# Altium project Core_MultiBoard.PrjPCB
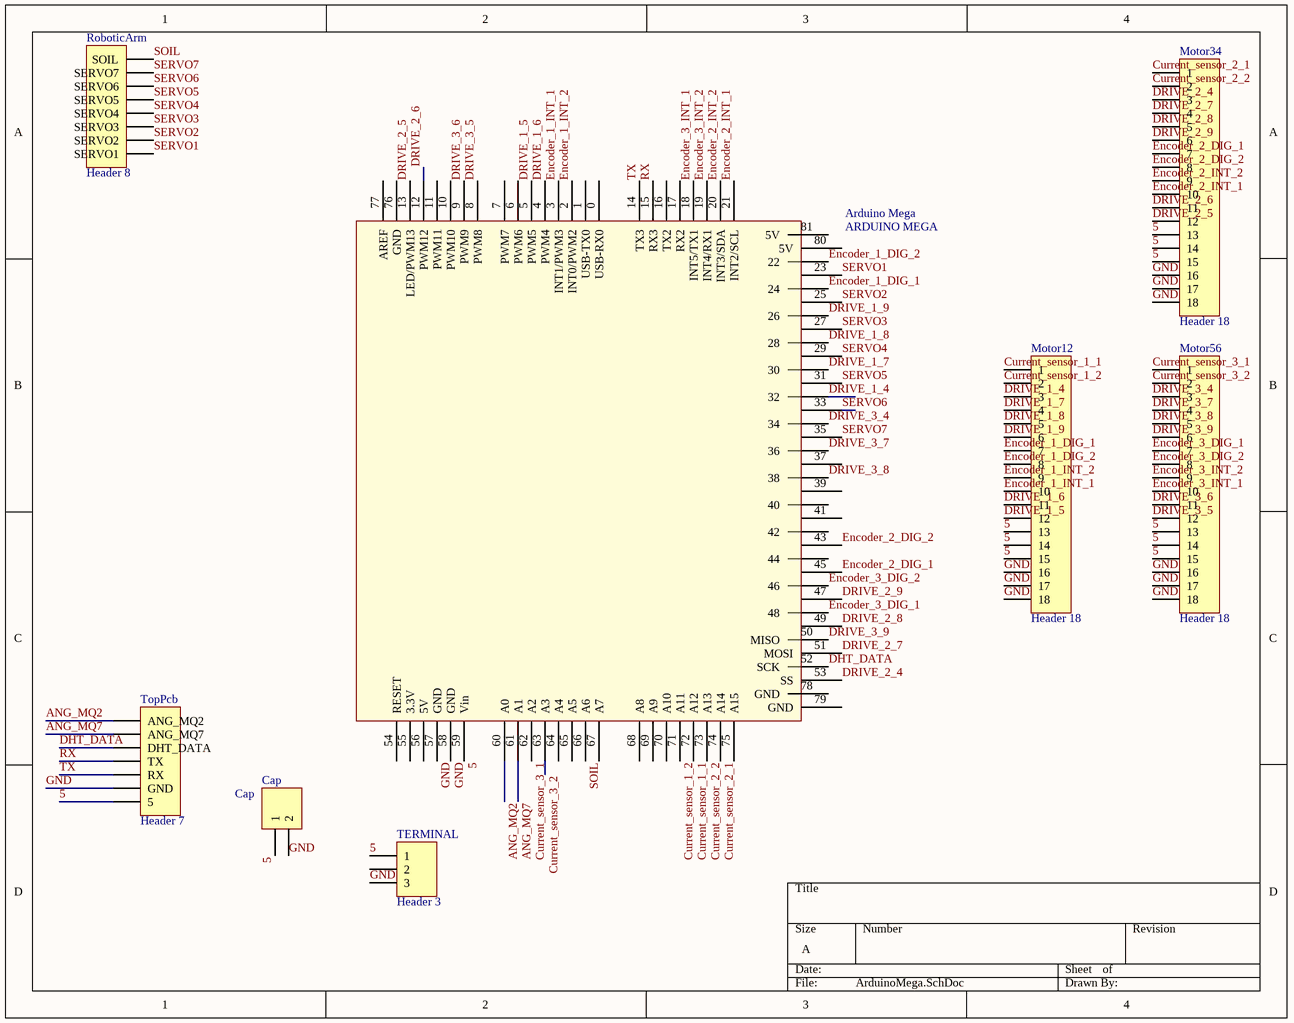
[diagram p0: ArduinoMega.SchDoc]
2 sheets, 11 parts. Net scope: global (net labels, ports and power ports of the same name join across sheets).
Board files: ArduinoMega.PcbDoc, MotorDriver.PcbDoc
Sheets:
  ArduinoMega.SchDoc
  MotorDriver.SchDoc

## Sheet ArduinoMega.SchDoc
size A; SheetNumber: 1; SheetTotal: 1

### Parts
Arduino_Mega  ARDUINO MEGA  [ARDUINO MEGA]
Cap  Cap  [HDR1X2]
Motor12  Header 18  [HDR1X18]
Motor34  Header 18  [HDR1X18]
Motor56  Header 18  [HDR1X18]
RoboticArm  Header 8  [HDR1X8]
TERMINAL  Header 3  [HDR1X3]
TopPcb  Header 7  [HDR1X7]

### Nets
5: Arduino_Mega.59(Vin) Cap.1 Motor12.13 Motor12.14 Motor12.15 Motor34.13 Motor34.14 Motor34.15 Motor56.13 Motor56.14 Motor56.15 TERMINAL.1 TopPcb.7(5)
ANG_MQ2: Arduino_Mega.60(A0) TopPcb.1(ANG_MQ2)
ANG_MQ7: Arduino_Mega.61(A1) TopPcb.2(ANG_MQ7)
Current_sensor_1_1: Arduino_Mega.72(A12) Motor12.1
Current_sensor_1_2: Arduino_Mega.71(A11) Motor12.2
Current_sensor_2_1: Arduino_Mega.74(A14) Motor34.1
Current_sensor_2_2: Arduino_Mega.73(A13) Motor34.2
Current_sensor_3_1: Arduino_Mega.62(A2) Motor56.1
Current_sensor_3_2: Arduino_Mega.63(A3) Motor56.2
DHT_DATA: Arduino_Mega.52(SCK) TopPcb.3(DHT_DATA)
DRIVE_1_4: Arduino_Mega.32 Motor12.3
DRIVE_1_5: Arduino_Mega.5(PWM5) Motor12.12
DRIVE_1_6: Arduino_Mega.4(PWM4) Motor12.11
DRIVE_1_7: Arduino_Mega.30 Motor12.4
DRIVE_1_8: Arduino_Mega.28 Motor12.5
DRIVE_1_9: Arduino_Mega.26 Motor12.6
DRIVE_2_4: Arduino_Mega.53(SS) Motor34.3
DRIVE_2_5: Arduino_Mega.13(LED/PWM13) Motor34.12
DRIVE_2_6: Arduino_Mega.12(PWM12) Motor34.11
DRIVE_2_7: Arduino_Mega.51(MOSI) Motor34.4
DRIVE_2_8: Arduino_Mega.49 Motor34.5
DRIVE_2_9: Arduino_Mega.47 Motor34.6
DRIVE_3_4: Arduino_Mega.34 Motor56.3
DRIVE_3_5: Arduino_Mega.8(PWM8) Motor56.12
DRIVE_3_6: Arduino_Mega.9(PWM9) Motor56.11
DRIVE_3_7: Arduino_Mega.36 Motor56.4
DRIVE_3_8: Arduino_Mega.38 Motor56.5
DRIVE_3_9: Arduino_Mega.50(MISO) Motor56.6
Encoder_1_DIG_1: Arduino_Mega.24 Motor12.7
Encoder_1_DIG_2: Arduino_Mega.22 Motor12.8
Encoder_1_INT_1: Arduino_Mega.3(INT1/PWM3) Motor12.10
Encoder_1_INT_2: Arduino_Mega.2(INT0/PWM2) Motor12.9
Encoder_2_DIG_1: Arduino_Mega.45 Motor34.7
Encoder_2_DIG_2: Arduino_Mega.43 Motor34.8
Encoder_2_INT_1: Arduino_Mega.21(INT2/SCL) Motor34.10
Encoder_2_INT_2: Arduino_Mega.20(INT3/SDA) Motor34.9
Encoder_3_DIG_1: Arduino_Mega.48 Motor56.7
Encoder_3_DIG_2: Arduino_Mega.46 Motor56.8
Encoder_3_INT_1: Arduino_Mega.18(INT5/TX1) Motor56.10
Encoder_3_INT_2: Arduino_Mega.19(INT4/RX1) Motor56.9
GND: Arduino_Mega.57(GND) Arduino_Mega.58(GND) Cap.2 Motor12.16 Motor12.17 Motor12.18 Motor34.16 Motor34.17 Motor34.18 Motor56.16 Motor56.17 Motor56.18 TERMINAL.3 TopPcb.6(GND)
RX: Arduino_Mega.15(RX3) TopPcb.4(TX)
SERVO1: Arduino_Mega.23 RoboticArm.1(SERVO1)
SERVO2: Arduino_Mega.25 RoboticArm.2(SERVO2)
SERVO3: Arduino_Mega.27 RoboticArm.3(SERVO3)
SERVO4: Arduino_Mega.29 RoboticArm.4(SERVO4)
SERVO5: Arduino_Mega.31 RoboticArm.5(SERVO5)
SERVO6: Arduino_Mega.33 RoboticArm.6(SERVO6)
SERVO7: Arduino_Mega.35 RoboticArm.7(SERVO7)
SOIL: Arduino_Mega.66(A6) RoboticArm.8(SOIL)
TX: Arduino_Mega.14(TX3) TopPcb.5(RX)

Not connected (* = marked no-connect by the designer): Arduino_Mega 0(USB-RX0) 1(USB-TX0) 6(PWM6) 7(PWM7) 10(PWM10) 11(PWM11) 16(TX2) 17(RX2) 37 39 40 41 42 44 54(RESET) 55(3.3V) 56(5V) 64(A4) 65(A5) 67(A7) 68(A8) 69(A9) 70(A10) 75(A15) 76(GND) 77(AREF) 78(GND) 79(GND) 80(5V) 81(5V); TERMINAL 2

### Library data of the parts
Cap = Header 2: Header, 2-Pin; LatestRevisionDate: 17-Jul-2002; LatestRevisionNote: Re-released for DXP Platform.; Publisher: Altium Limited
Motor12 Motor34 Motor56 = Header 18: Header, 18-Pin; LatestRevisionDate: 17-Jul-2002; LatestRevisionNote: Re-released for DXP Platform.; Publisher: Altium Limited
RoboticArm = Header 8: Header, 8-Pin; LatestRevisionDate: 17-Jul-2002; LatestRevisionNote: Re-released for DXP Platform.; Publisher: Altium Limited
TERMINAL = Header 3: Header, 3-Pin; LatestRevisionDate: 17-Jul-2002; LatestRevisionNote: Re-released for DXP Platform.; Publisher: Altium Limited
TopPcb = Header 7: Header, 7-Pin; LatestRevisionDate: 17-Jul-2002; LatestRevisionNote: Re-released for DXP Platform.; Publisher: Altium Limited

## Sheet MotorDriver.SchDoc
size A
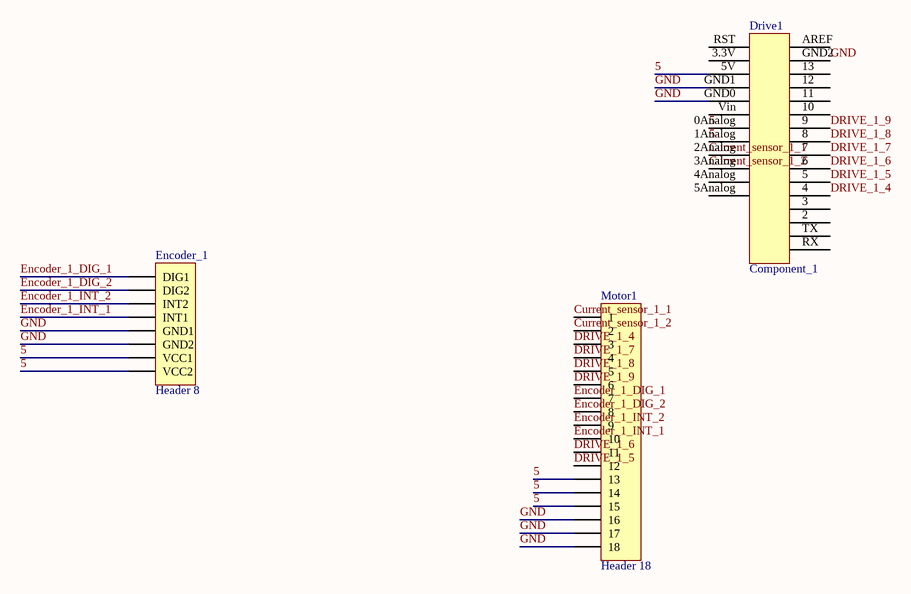
[diagram p1: MotorDriver.SchDoc]

### Parts
Drive1  Component_1  [PCBComponent_1]
Encoder_1  Header 8  [HDR1X8]
Motor1  Header 18  [HDR1X18]

### Nets
5: Drive1.0Analog Drive1.1Analog Drive1.5V Encoder_1.7(VCC1) Encoder_1.8(VCC2) Motor1.13 Motor1.14 Motor1.15
Current_sensor_1_1: Drive1.2Analog Motor1.1
Current_sensor_1_2: Drive1.3Analog Motor1.2
DRIVE_1_4: Drive1.4 Motor1.3
DRIVE_1_5: Drive1.5 Motor1.12
DRIVE_1_6: Drive1.6 Motor1.11
DRIVE_1_7: Drive1.7 Motor1.4
DRIVE_1_8: Drive1.8 Motor1.5
DRIVE_1_9: Drive1.9 Motor1.6
Encoder_1_DIG_1: Encoder_1.1(DIG1) Motor1.7
Encoder_1_DIG_2: Encoder_1.2(DIG2) Motor1.8
Encoder_1_INT_1: Encoder_1.4(INT1) Motor1.10
Encoder_1_INT_2: Encoder_1.3(INT2) Motor1.9
GND: Drive1.GND0 Drive1.GND1 Drive1.GND2 Encoder_1.5(GND1) Encoder_1.6(GND2) Motor1.16 Motor1.17 Motor1.18

Not connected (* = marked no-connect by the designer): Drive1 2 3 3.3V 4Analog 5Analog 10 11 12 13 AREF RST RX TX Vin

### Library data of the parts
Encoder_1 = Header 8: Header, 8-Pin; LatestRevisionDate: 17-Jul-2002; LatestRevisionNote: Re-released for DXP Platform.; Publisher: Altium Limited
Motor1 = Header 18: Header, 18-Pin; LatestRevisionDate: 17-Jul-2002; LatestRevisionNote: Re-released for DXP Platform.; Publisher: Altium Limited

## Nets that join several sheets
5: ArduinoMega (13 pins), MotorDriver (8 pins)
Current_sensor_1_1: ArduinoMega (Arduino_Mega.72 Motor12.1), MotorDriver (Drive1.2Analog Motor1.1)
Current_sensor_1_2: ArduinoMega (Arduino_Mega.71 Motor12.2), MotorDriver (Drive1.3Analog Motor1.2)
DRIVE_1_4: ArduinoMega (Arduino_Mega.32 Motor12.3), MotorDriver (Drive1.4 Motor1.3)
DRIVE_1_5: ArduinoMega (Arduino_Mega.5 Motor12.12), MotorDriver (Drive1.5 Motor1.12)
DRIVE_1_6: ArduinoMega (Arduino_Mega.4 Motor12.11), MotorDriver (Drive1.6 Motor1.11)
DRIVE_1_7: ArduinoMega (Arduino_Mega.30 Motor12.4), MotorDriver (Drive1.7 Motor1.4)
DRIVE_1_8: ArduinoMega (Arduino_Mega.28 Motor12.5), MotorDriver (Drive1.8 Motor1.5)
DRIVE_1_9: ArduinoMega (Arduino_Mega.26 Motor12.6), MotorDriver (Drive1.9 Motor1.6)
Encoder_1_DIG_1: ArduinoMega (Arduino_Mega.24 Motor12.7), MotorDriver (Encoder_1.1 Motor1.7)
Encoder_1_DIG_2: ArduinoMega (Arduino_Mega.22 Motor12.8), MotorDriver (Encoder_1.2 Motor1.8)
Encoder_1_INT_1: ArduinoMega (Arduino_Mega.3 Motor12.10), MotorDriver (Encoder_1.4 Motor1.10)
Encoder_1_INT_2: ArduinoMega (Arduino_Mega.2 Motor12.9), MotorDriver (Encoder_1.3 Motor1.9)
GND: ArduinoMega (14 pins), MotorDriver (8 pins)